# Altium schematic sheet DAC.SchDoc
size A4
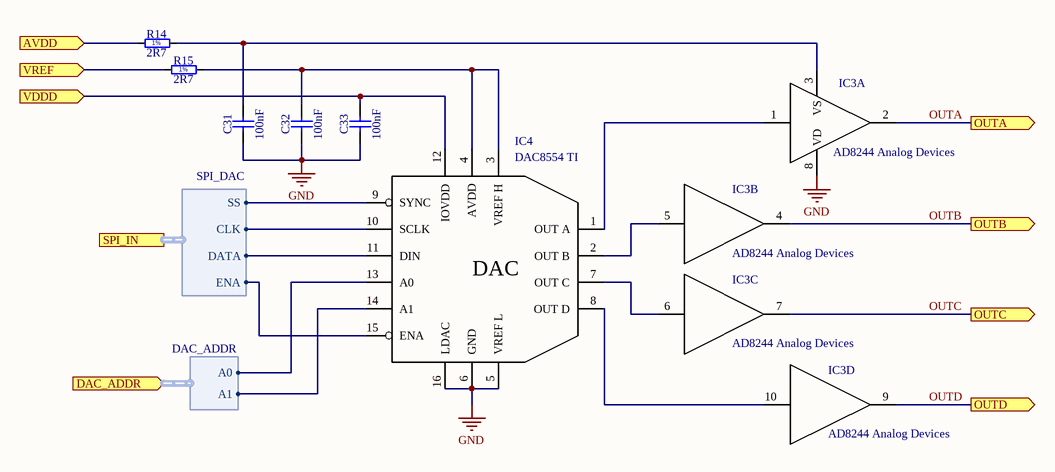
[diagram p0: DAC.SchDoc]

## Parts
C31  100nF  [CAPC2012X135N]
C32  100nF  [CAPC2012X135N]
C33  100nF  [CAPC2012X135N]
IC3  AD8244 Analog Devices  [TSSOP50P490X110-10N]  (parts A,B,C,D of 4)
IC4  DAC8554 TI  [TSOP65P640X120-16N]
R14  2R7  [RESC2012X60N]
R15  2R7  [RESC2012X60N]

## Ports
AVDD (in), DAC_ADDR (in, harness DAC_ADDR), OUTA (out), OUTB (out), OUTC (out), OUTD (out), SPI_IN (harness SPI_DAC), VDDD (in), VREF (in)

## Harnesses
SPI_DAC: DATA, CLK, SS, ENA
DAC_ADDR: A0, A1

## Nets
GND: C31.1 C32.1 C33.1 IC3.8(VD) IC4.5(VREF_L) IC4.6(GND) IC4.16(LDAC)
AVDD: R14.1 ; port AVDD
OUTA: IC3.2(OUT_A) ; port OUTA
OUTB: IC3.4(OUT_B) ; port OUTB
OUTC: IC3.7(OUT_C) ; port OUTC
OUTD: IC3.9(OUT_D) ; port OUTD
VDDD: C33.2 IC4.12(IOVDD) ; port VDDD
VREF: R15.1 ; port VREF
NetC31_2: C31.2 IC3.3(VS) R14.2
NetC32_2: C32.2 IC4.3(VREF_H) IC4.4(AVDD) R15.2
NetIC3_1: IC3.1(IN_A) IC4.1(OUT_A)
NetIC3_5: IC3.5(IN_B) IC4.2(OUT_B)
NetIC3_6: IC3.6(IN_C) IC4.7(OUT_C)
NetIC3_10: IC3.10(IN_D) IC4.8(OUT_D)
NetIC4_9: IC4.9(SYNC) ; port SPI_IN.SS
NetIC4_10: IC4.10(SCLK) ; port SPI_IN.CLK
NetIC4_11: IC4.11(DIN) ; port SPI_IN.DATA
NetIC4_13: IC4.13(A0) ; port DAC_ADDR.A0
NetIC4_14: IC4.14(A1) ; port DAC_ADDR.A1
NetIC4_15: IC4.15(ENA) ; port SPI_IN.ENA

## Notes on the sheet
- (in symbol DAC8554) DAC
- (in symbol R0805_2R7_1%_0.125W_200PPM) 1%

## Library data of the parts
C31-C33 = CC0805_100NF_50V_10%_X7R: Non-polarised capacitor; Part Description: SMD Multilayer Chip Ceramic Capacitor; Manufacturer: GENERIC; Manufacturer1 Part Number: C2012X7R1H104K085AA; Voltage: 50V; TC: X7R; Tolerance: ±10%; Part Number: CC0805_100NF_50V_10%_X7R; Component Kind: Standard; Component Type: Standard; Pin Count: 2; Value: 100nF; Status: Preferred; Manufacturer Part Number: CC0805_100NF_50V_10%_X7R; Case: 0805; Mounted: Yes; Socket: No; SMD: Yes; Sense: No; Manufacturer1 Example: TDK; Manufacturer1 ComponentHeight: 1mm; HelpURL: \\cern.ch\dfs\Applications\Altium\Datasheets\CC0805_X7R_TDK_C.pdf; Author: CERN DEM JLC; CreateDate: 03.12.2007; LatestRevisionDate: 22.04.2015
IC3 = AD8244: Name: AD8244; Manufacturer: Analog Devices
IC4 = DAC8554: Name: DAC8554; Manufacturer: TI
R14 R15 = R0805_2R7_1%_0.125W_200PPM: Resistor - 1%; Part Description: General Purpose Thick Film Chip Resistor; Manufacturer: GENERIC; Manufacturer1 Part Number: 232273462708L or RC0805FR-072R7L; Power: 0.125W; TC: ±200ppm/°C; PressFit: No; Part Number: R0805_2R7_1%_0.125W_200PPM; Component Kind: Standard; Component Type: Standard; Pin Count: 2; Value: 2R7; Status: Preferred; Tolerance: ±1%; Manufacturer Part Number: R0805_2R7_1%_0.125W_200PPM; Case: 0805; Mounted: Yes; Sense: No; Socket: No; SMD: Yes; Manufacturer1 Example: YAGEO PHYCOMP; Manufacturer1 ComponentHeight: 0.65mm; HelpURL: \\cern.ch\dfs\Applications\Altium\Datasheets\R0805_Phycomp_RC0805.pdf; Author: CERN DEM JLC; CreateDate: 03.12.2007; LatestRevisionDate: 17.10.2012